# EAGLE design Lamp3 (EAGLE 8.0.1)
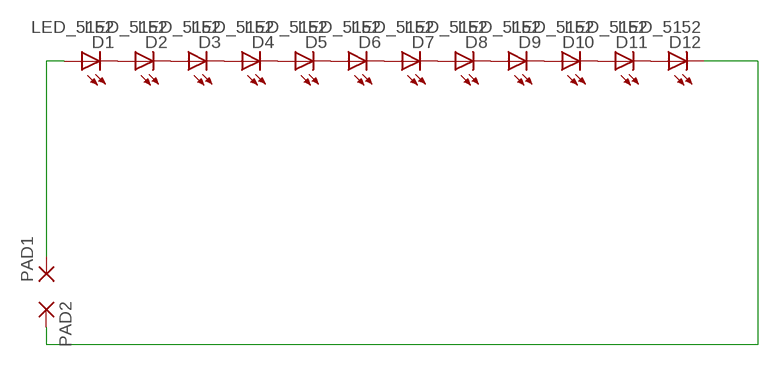
[diagram p0: schematic, sheet 1]

## Parts
D1  LED_5152  [LED-5152]
D2  LED_5152  [LED-5152]
D3  LED_5152  [LED-5152]
D4  LED_5152  [LED-5152]
D5  LED_5152  [LED-5152]
D6  LED_5152  [LED-5152]
D7  LED_5152  [LED-5152]
D8  LED_5152  [LED-5152]
D9  LED_5152  [LED-5152]
D10  LED_5152  [LED-5152]
D11  LED_5152  [LED-5152]
D12  LED_5152  [LED-5152]
PAD1  SMD5  [SMD2,54-5,08]
PAD2  SMD5  [SMD2,54-5,08]

## Nets
1: D1.A PAD1.1(P)
2: D1.C D2.A
3: D2.C D3.A
4: D3.C D4.A
5: D4.C D5.A
6: D5.C D6.A
7: D6.C D7.A
8: D7.C D8.A
9: D8.C D9.A
10: D9.C D10.A
11: D10.C D11.A
12: D11.C D12.A
13: D12.C PAD2.1(P)

## Library data of the parts
D1-D12 = Namenlos:LED_
PAD1 PAD2 = wirepad:SMD5: SMD PAD

## Board
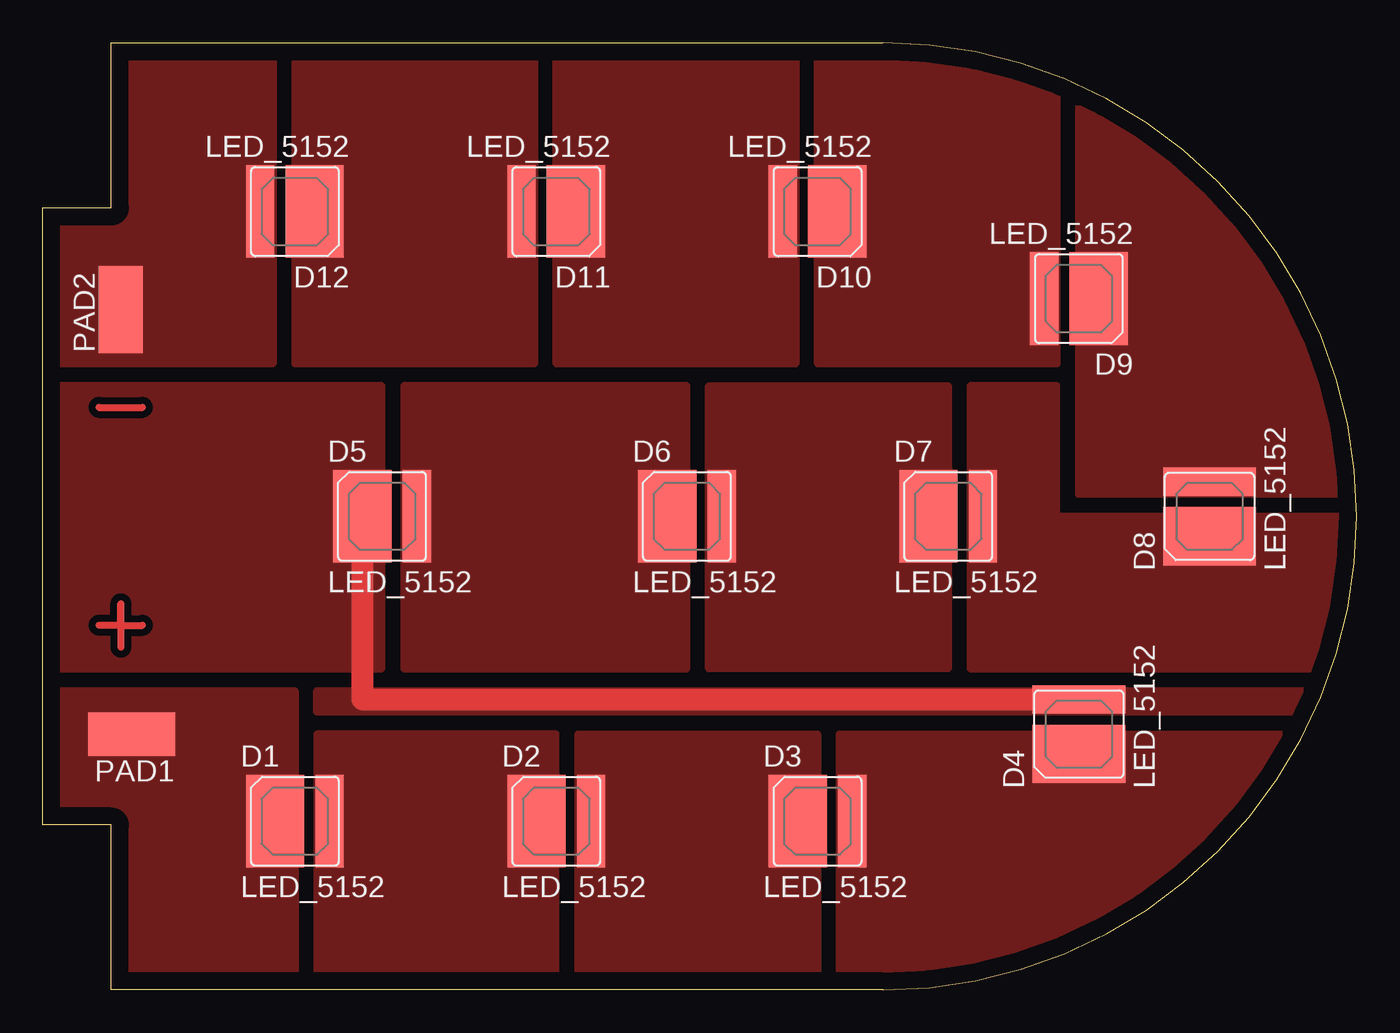
[diagram p1: board, top side]

Size 76.62 x 55.24 mm. Coordinates in mm from the lower left corner, seen from the top.
Outline: 4,9.62 0,9.62 0,45.62 4,45.62 4,55.24 49,55.24 arc-180 49,0 4,0 4,9.62
Copper layers (1*16): Top 0.035mm / dielectric 1.5mm / Bottom 0.035mm
Design rules "default": minimum track width 10mil, minimum drill 24mil, track to track 8mil, track to pad 8mil, pad to pad 8mil, via to via 8mil, smd to smd 8mil, copper to edge 40mil, drill to drill 8mil, minimum pad ring 10mil, minimum via ring 8mil, stop-mask expansion 4mil, vias tented up to drill 0mil, thermal gap 10mil

### Footprints (pad centres in the part's own frame; a part is rotated, then mirrored left to right if it is on the bottom)
LED-5152 = smd 3.4 x 5.4: A -1.15,0 | smd 1.65 x 5.4: C 2.025,0
SMD2,54-5,08 = smd 2.54 x 5.08: 1 0,0

### Placement (x,y rotation side)
D1  14.7,9.84 0 top
D2  29.94,9.84 0 top
D3  45.18,9.84 0 top
D4  60.42,14.92 90 top
D5  19.78,27.62 0 top
D6  37.56,27.62 0 top
D7  52.8,27.62 0 top
D8  68.04,27.62 90 top
D9  60.42,40.32 180 top
D10  45.18,45.4 180 top
D11  29.94,45.4 180 top
D12  14.7,45.4 180 top
PAD1  5.17,14.92 90 top
PAD2  4.54,39.69 0 top

### Tracks (layer width: path | path; a pad name or v marks a point on that pad's centre or on a via)
1
  pour Top (no thermals): 14.7,17.46 14.7,-0.32 -0.54,-0.32 -0.54,17.46
2
  pour Top (no thermals): 29.94,-0.32 29.94,14.92 15.97,14.92 15.97,-0.32
3
  pour Top (no thermals): 45.18,14.92 45.18,-0.32 31.21,-0.32 31.21,14.92
4
  pour Top (no thermals): 46.45,14.92 78.2,14.92 78.2,-0.32 46.45,-0.32
5
  Top 1.27: D5.A 18.63,16.95 D4.C
  pour Top (no thermals): 15.97,17.46 78.2,17.46 78.2,16.19 15.97,16.19
  pour Top (isolate 0.406, no thermals): 19.78,18.73 19.78,35.24 -0.54,35.24 -0.54,18.73
6
  pour Top (no thermals): 37.56,18.73 37.56,35.24 21.05,35.24 21.05,18.73
7
  pour Top (no thermals): 52.8,18.73 38.83,18.73 38.83,35.24 52.8,35.24
8
  pour Top (no thermals): 78.2,27.62 59.15,27.62 59.15,35.24 54.07,35.24 54.07,18.73 78.2,18.73
9
  pour Top (no thermals): 60.42,28.89 60.42,55.56 78.2,55.56 78.2,28.89
10
  pour Top (no thermals): 45.18,36.51 45.18,55.56 59.15,55.56 59.15,36.51
11
  pour Top (no thermals): 29.94,36.51 29.94,55.56 43.91,55.56 43.91,36.51
12
  pour Top (no thermals): 14.7,36.51 14.7,55.56 28.67,55.56 28.67,36.51
13
  pour Top (no thermals): 13.43,55.56 13.43,36.51 -0.54,36.51 -0.54,55.56
+
  Top 0.406: 4.54,21.27 3.27,21.27 | 4.54,21.27 5.81,21.27 | 4.54,21.27 4.54,22.54 4.54,21.27 | 4.54,21.27 4.54,20
-
  Top 0.406: 3.27,33.97 5.81,33.97

### Text on the board
200bmp: C:/EAGLE-7.7.0/Untitled-1.bmp